# EasyEDA schematic SCH_Contaier 90mm_2022-04-15.json
TITLE: Container PCB; REV: 1.0; Date: 13-04-2022; Sheet: 1/1; Drawn By: Nipun Gupta; Company: Garuda 1095
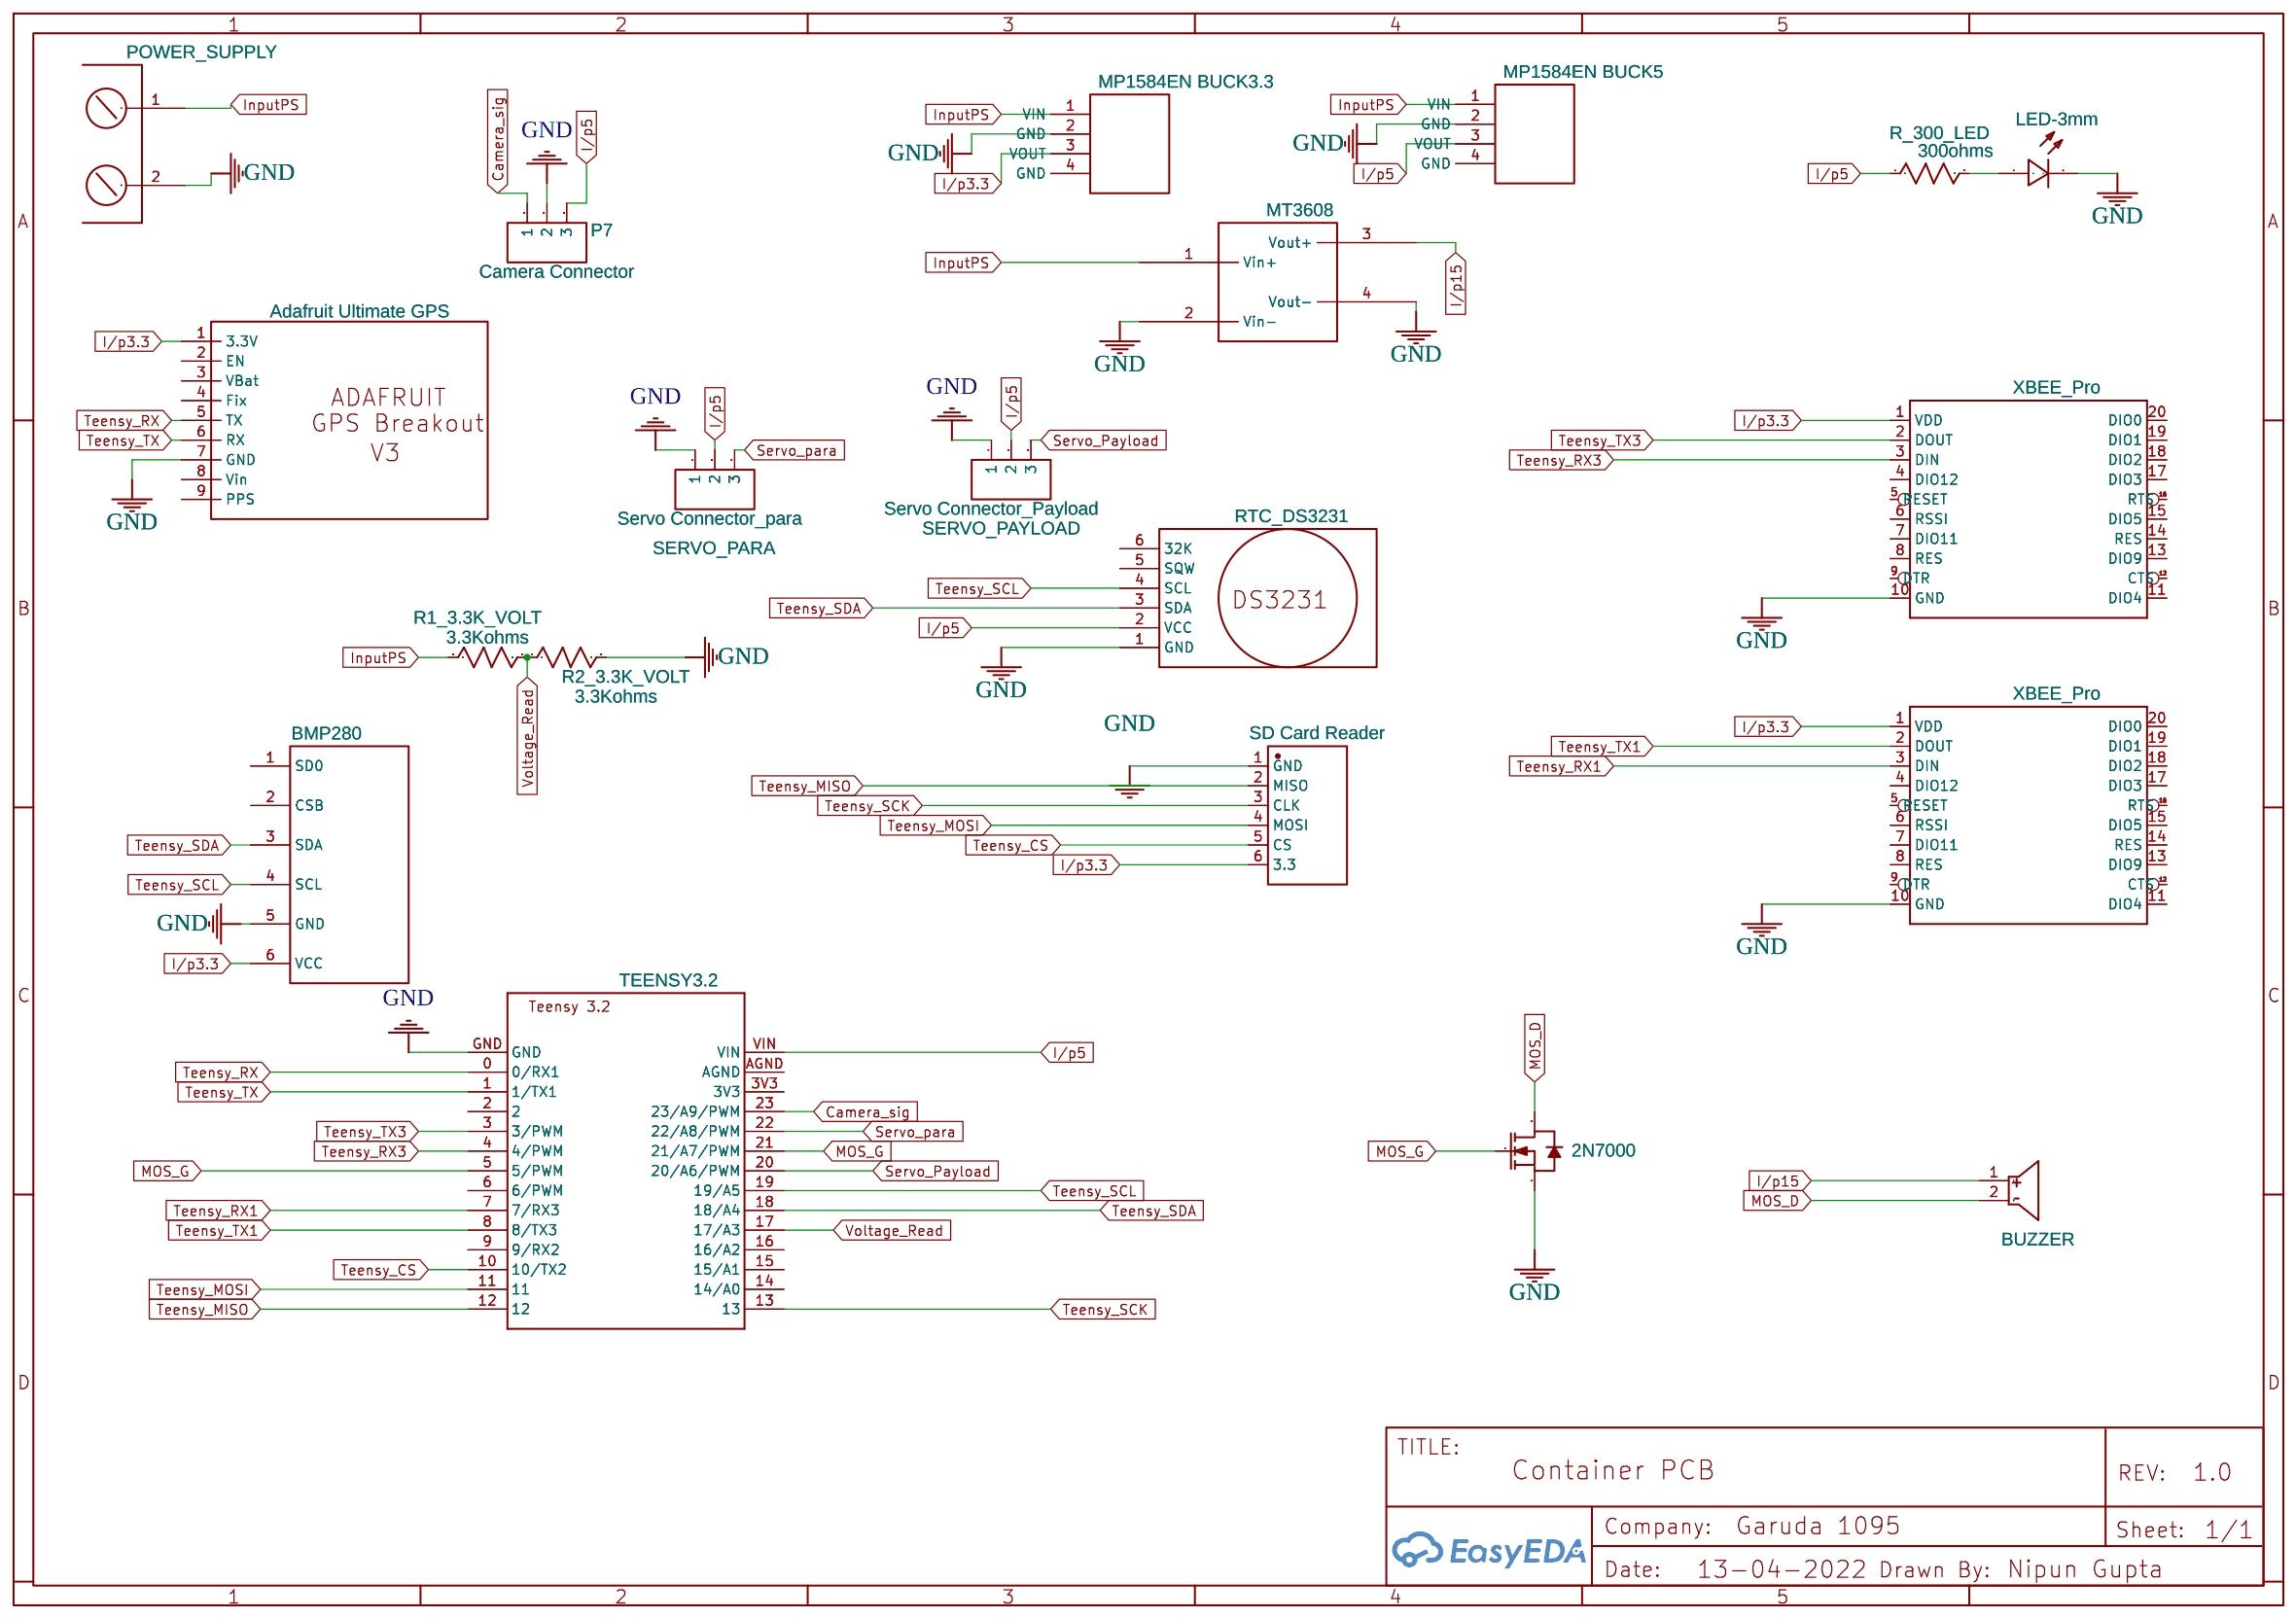
[diagram p0: schematic sheet]

## Parts
BUZZER  FMQ-BUZZER2  [BUZ-TH_BD12.0-P7.60-D0.6-FD]
J1  POWER_SUPPLY  [5A_2PIN-TERMINALBLOCK]
JP2  XBEE_Pro  [XBEE-PRO-]
JP3  XBEE_Pro  [XBEE-PRO-]
LED1  LED-3mm  [LED-3MM/2.54]
P7  Camera Connector  [HDR-TH_3P-P2.54-V-F]
PRESS1  BMP280  [BMP 280 FOOT]
Q1  2N7000  [TO-92-3_L4.9-W3.7-P1.27-L]
R1_3.3K_VOLT  3.3Kohms  [AXIAL-0.3]
R2_3.3K_VOLT  3.3Kohms  [AXIAL-0.3]
R_300_LED  300ohms  [AXIAL-0.3]
SD-READER3  SD Card Reader  [SD CARD READER FOOT]
SERVO_PARA  Servo Connector_para  [HDR-TH_3P-P2.54-V-F]
SERVO_PAYLOAD  Servo Connector_Payload  [HDR-TH_3P-P2.54-V-F]
U1  Adafruit Ultimate GPS  [ADAFRUIT GPS BREAKOUT]
U2  MP1584EN BUCK5  [MP1584EN]
U3  MP1584EN BUCK3.3  [MP1584EN]
U5  TEENSY3.2  [TEENSY3.2]
U6  MT3608  [MT3608]
U17  RTC_DS3231  [DS3231]

## Library data of the parts
BUZZER = FMQ-BUZZER2: Supplier: LCSC; Supplier Part: C9900006103; JLCPCB Part Class: Extended Part; Contributor: LCSC
J1 = 2pin_5A_TerminalBlock: Contributor: Obeng_smd
JP2 JP3 = XBEE_Pro: Digi XBee and XBee Pro; Contributor: Dev 91
LED1 = -: Supplier: LCSC; Manufacturer: EVERLIGHT; Manufacturer Part: 204-10SURD/S530-A3; Supplier Part: C99772
P7 SERVO_PARA SERVO_PAYLOAD = Header-Female-2.54_1x3: Supplier Part: C146243; Supplier: LCSC; Manufacturer: Boom Precision Elec; link: https://datasheet.lcsc.com/szlcsc/Boom-Precision-Elec-2-54mm-1-8P-Straight-Female-header_C27438.pdf; JLCPCB Part Class: Extended Part
PRESS1 = BMP280 Sparkfun: Contributor: NIPUN GUPTA; sourceId: 6GASa4mDV; Manufacturer Part: ?
Q1 = 2N7000BU: Supplier: LCSC; Supplier Part: C896650; Manufacturer: onsemi(安森美); Contributor: LCSC
R1_3.3K_VOLT R2_3.3K_VOLT R_300_LED = Res_AXIAL-0.3(1/8W)_US: Manufacturer Part: ?; Package Display: No
SD-READER3 = Micro SD Card Reader: Manufacturer Part: SD card reader 17.9x17.9; Contributor: Tinerfe; Supplier: AliExpress; Manufacturer: ShengYang; link: https://www.aliexpress.com/item/32867572635.html
U1 = Adafruit Ultimate GPS Breakout V3: Manufacturer Part: New SchematicLib; Contributor: NiklasC; Supplier Part: 746; Supplier: Adafruit; link: https://www.adafruit.com/product/746
U2 U3 = MP1584EN COPY: Contributor: babeinlovexd
U5 = TEENSY3.2: Contributor: OldJeffer
U6 = MT3608: Contributor: CDEI-UPC
U17 = UhrModul_DS3231: Contributor: Muffel

## Nets
GND: J1.2 JP2.10(GND) JP3.10(GND) LED1.2(-) P7.2 PRESS1.5(GND) Q1.1(S) R2_3.3K_VOLT.2 SD-READER3.1(GND) SERVO_PARA.1 SERVO_PAYLOAD.1 U1.7(GND) U2.2(GND) U3.2(GND) U5.GND U6.2(Vin-) U6.4(Vout-) U17.1(GND)
Camera_sig: P7.1 U5.23(23/A9/PWM)
I/p3.3: JP2.1(VDD) JP3.1(VDD) PRESS1.6(VCC) SD-READER3.6(3.3) U1.1(3.3V) U3.3(VOUT)
I/p5: P7.3 R_300_LED.1 SERVO_PARA.2 SERVO_PAYLOAD.2 U2.3(VOUT) U5.VIN U17.2(VCC)
I/p15: BUZZER.1 U6.3(Vout+)
InputPS: J1.1 R1_3.3K_VOLT.1 U2.1(VIN) U3.1(VIN) U6.1(Vin+)
MOS_D: BUZZER.2 Q1.3(D)
MOS_G: Q1.2(G) U5.5(5/PWM) U5.21(21/A7/PWM)
Servo_para: SERVO_PARA.3 U5.22(22/A8/PWM)
Servo_Payload: SERVO_PAYLOAD.3 U5.20(20/A6/PWM)
Teensy_CS: SD-READER3.5(CS) U5.10(10/TX2)
Teensy_MISO: SD-READER3.2(MISO) U5.12
Teensy_MOSI: SD-READER3.4(MOSI) U5.11
Teensy_RX: U1.5(TX) U5.0(0/RX1)
Teensy_RX1: JP2.3(DIN) U5.7(7/RX3)
Teensy_RX3: JP3.3(DIN) U5.4(4/PWM)
Teensy_SCK: SD-READER3.3(CLK) U5.13
Teensy_SCL: PRESS1.4(SCL) U5.19(19/A5) U17.4(SCL)
Teensy_SDA: PRESS1.3(SDA) U5.18(18/A4) U17.3(SDA)
Teensy_TX: U1.6(RX) U5.1(1/TX1)
Teensy_TX1: JP2.2(DOUT) U5.8(8/TX3)
Teensy_TX3: JP3.2(DOUT) U5.3(3/PWM)
Voltage_Read: R1_3.3K_VOLT.2 R2_3.3K_VOLT.1 U5.17(17/A3)
Net-(LED1-1): LED1.1(+) R_300_LED.2

Not connected (* = marked no-connect by the designer): JP2 4(DIO12) 5(RESET) 6(RSSI) 7(DIO11) 8(RES) 9(DTR) 11(DIO4) 12(CTS) 13(DIO9) 14(RES) 15(DIO5) 16(RTS) 17(DIO3) 18(DIO2) 19(DIO1) 20(DIO0); JP3 4(DIO12) 5(RESET) 6(RSSI) 7(DIO11) 8(RES) 9(DTR) 11(DIO4) 12(CTS) 13(DIO9) 14(RES) 15(DIO5) 16(RTS) 17(DIO3) 18(DIO2) 19(DIO1) 20(DIO0); PRESS1 1(SD0) 2(CSB); U1 2(EN) 3(VBat) 4(Fix) 8(Vin) 9(PPS); U2 4(GND); U3 4(GND); U5 2 3V3 6(6/PWM) 9(9/RX2) 14(14/A0) 15(15/A1) 16(16/A2) AGND; U17 5(SQW) 6(32K)
